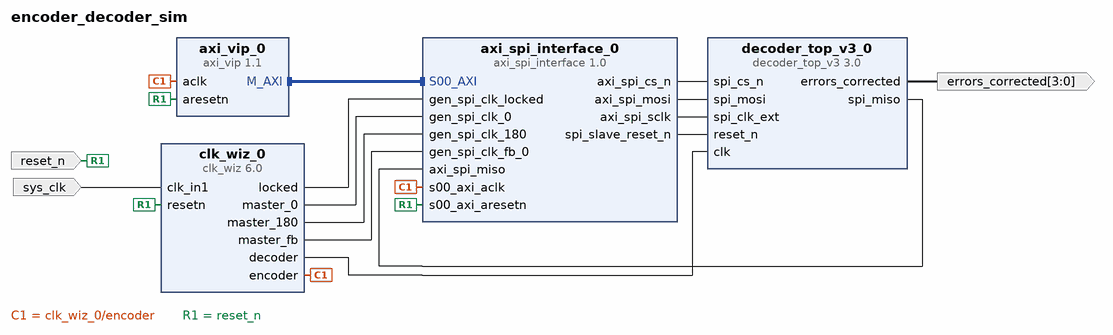
[diagram p0: block diagram of the top level]
# Vivado block design encoder_decoder_sim, xc7z020clg484-1, Vivado 2022.1
create_bd_design encoder_decoder_sim

create_bd_port -dir I -type rst reset_n
create_bd_port -dir I -type clk sys_clk
set_property -dict {CONFIG.FREQ_HZ 100000000} [get_bd_ports sys_clk]
create_bd_port -dir O -from 3 -to 0 -type data errors_corrected

create_bd_cell -type ip -vlnv xilinx.com:user:axi_spi_interface:1.0 axi_spi_interface_0
set_property -dict [list \
  CONFIG.SPI_CLK_FB_DELAY_WIDTH 4 \
  CONFIG.SPI_DUMMY_BITS_BEG 1 \
  CONFIG.SPI_DUMMY_BITS_END 1 \
  CONFIG.SPI_INIT_INTERVAL 1 \
  CONFIG.SPI_SHIFT_IN_COMP 1 \
] [get_bd_cells axi_spi_interface_0]
create_bd_cell -type ip -vlnv xilinx.com:ip:axi_vip:1.1 axi_vip_0
set_property -dict [list \
  CONFIG.ADDR_WIDTH 32 \
  CONFIG.DATA_WIDTH 32 \
  CONFIG.HAS_BRESP 1 \
  CONFIG.HAS_PROT 1 \
  CONFIG.HAS_RRESP 1 \
  CONFIG.HAS_WSTRB 1 \
  CONFIG.INTERFACE_MODE MASTER \
  CONFIG.PROTOCOL AXI4LITE \
  CONFIG.READ_WRITE_MODE READ_WRITE \
] [get_bd_cells axi_vip_0]
create_bd_cell -type ip -vlnv xilinx.com:ip:clk_wiz:6.0 clk_wiz_0
set_property -dict [list \
  CONFIG.CLKOUT1_JITTER 159.475 \
  CONFIG.CLKOUT1_PHASE_ERROR 105.461 \
  CONFIG.CLKOUT1_REQUESTED_OUT_FREQ 50.000 \
  CONFIG.CLKOUT2_JITTER 159.475 \
  CONFIG.CLKOUT2_PHASE_ERROR 105.461 \
  CONFIG.CLKOUT2_REQUESTED_OUT_FREQ 50.000 \
  CONFIG.CLKOUT2_REQUESTED_PHASE 180.000 \
  CONFIG.CLKOUT2_USED true \
  CONFIG.CLKOUT3_JITTER 137.681 \
  CONFIG.CLKOUT3_PHASE_ERROR 105.461 \
  CONFIG.CLKOUT3_USED true \
  CONFIG.CLKOUT4_JITTER 137.681 \
  CONFIG.CLKOUT4_PHASE_ERROR 105.461 \
  CONFIG.CLKOUT4_REQUESTED_PHASE 10.000 \
  CONFIG.CLKOUT4_USED true \
  CONFIG.CLKOUT5_JITTER 159.475 \
  CONFIG.CLKOUT5_PHASE_ERROR 105.461 \
  CONFIG.CLKOUT5_REQUESTED_OUT_FREQ 50.000 \
  CONFIG.CLKOUT5_USED true \
  CONFIG.CLKOUT6_JITTER 183.467 \
  CONFIG.CLKOUT6_PHASE_ERROR 105.461 \
  CONFIG.CLKOUT6_REQUESTED_OUT_FREQ 100.000 \
  CONFIG.CLKOUT6_REQUESTED_PHASE 0.000 \
  CONFIG.CLKOUT6_USED false \
  CONFIG.CLKOUT7_JITTER 183.467 \
  CONFIG.CLKOUT7_PHASE_ERROR 105.461 \
  CONFIG.CLKOUT7_REQUESTED_OUT_FREQ 100.000 \
  CONFIG.CLKOUT7_REQUESTED_PHASE 0.000 \
  CONFIG.CLKOUT7_USED false \
  CONFIG.CLK_OUT1_PORT master_0 \
  CONFIG.CLK_OUT2_PORT master_180 \
  CONFIG.CLK_OUT3_PORT encoder \
  CONFIG.CLK_OUT4_PORT decoder \
  CONFIG.CLK_OUT5_PORT master_fb \
  CONFIG.CLK_OUT6_PORT clk_out6 \
  CONFIG.CLK_OUT7_PORT clk_out7 \
  CONFIG.MMCM_CLKFBOUT_MULT_F 9.000 \
  CONFIG.MMCM_CLKOUT0_DIVIDE_F 18.000 \
  CONFIG.MMCM_CLKOUT1_DIVIDE 18 \
  CONFIG.MMCM_CLKOUT1_PHASE 180.000 \
  CONFIG.MMCM_CLKOUT2_DIVIDE 9 \
  CONFIG.MMCM_CLKOUT3_DIVIDE 9 \
  CONFIG.MMCM_CLKOUT3_PHASE 10.000 \
  CONFIG.MMCM_CLKOUT4_DIVIDE 18 \
  CONFIG.MMCM_CLKOUT5_DIVIDE 1 \
  CONFIG.MMCM_CLKOUT5_PHASE 0.000 \
  CONFIG.MMCM_CLKOUT6_DIVIDE 1 \
  CONFIG.MMCM_CLKOUT6_PHASE 0.000 \
  CONFIG.NUM_OUT_CLKS 5 \
  CONFIG.PRIM_IN_FREQ 100.000 \
  CONFIG.RESET_PORT resetn \
  CONFIG.RESET_TYPE ACTIVE_LOW \
] [get_bd_cells clk_wiz_0]
create_bd_cell -type ip -vlnv xilinx.com:user:decoder_top_v3:3.0 decoder_top_v3_0
set_property -dict {CONFIG.COMMS_DEBUG true CONFIG.SHIFT_IN_COMP 1} [get_bd_cells decoder_top_v3_0]

# ---- connections ----

connect_bd_intf_net [get_bd_intf_pins axi_vip_0/M_AXI] [get_bd_intf_pins axi_spi_interface_0/S00_AXI]
connect_bd_net [get_bd_pins axi_spi_interface_0/axi_spi_cs_n] [get_bd_pins decoder_top_v3_0/spi_cs_n]
connect_bd_net [get_bd_pins axi_spi_interface_0/axi_spi_mosi] [get_bd_pins decoder_top_v3_0/spi_mosi]
connect_bd_net [get_bd_pins axi_spi_interface_0/axi_spi_sclk] [get_bd_pins decoder_top_v3_0/spi_clk_ext]
connect_bd_net [get_bd_pins axi_spi_interface_0/spi_slave_reset_n] [get_bd_pins decoder_top_v3_0/reset_n]
connect_bd_net -net clk_wiz_0_clk_out3 [get_bd_pins clk_wiz_0/encoder] [get_bd_pins axi_spi_interface_0/s00_axi_aclk] [get_bd_pins axi_vip_0/aclk]
connect_bd_net [get_bd_pins clk_wiz_0/decoder] [get_bd_pins decoder_top_v3_0/clk]
connect_bd_net [get_bd_pins clk_wiz_0/locked] [get_bd_pins axi_spi_interface_0/gen_spi_clk_locked]
connect_bd_net [get_bd_pins clk_wiz_0/master_0] [get_bd_pins axi_spi_interface_0/gen_spi_clk_0]
connect_bd_net [get_bd_pins clk_wiz_0/master_180] [get_bd_pins axi_spi_interface_0/gen_spi_clk_180]
connect_bd_net [get_bd_pins clk_wiz_0/master_fb] [get_bd_pins axi_spi_interface_0/gen_spi_clk_fb_0]
connect_bd_net [get_bd_pins decoder_top_v3_0/errors_corrected] [get_bd_ports errors_corrected]
connect_bd_net [get_bd_pins decoder_top_v3_0/spi_miso] [get_bd_pins axi_spi_interface_0/axi_spi_miso]
connect_bd_net [get_bd_ports reset_n] [get_bd_pins axi_spi_interface_0/s00_axi_aresetn] [get_bd_pins axi_vip_0/aresetn] [get_bd_pins clk_wiz_0/resetn]
connect_bd_net [get_bd_ports sys_clk] [get_bd_pins clk_wiz_0/clk_in1]

# ---- address map ----
assign_bd_address -offset 0x44A00000 -range 64K -target_address_space [get_bd_addr_spaces axi_vip_0/Master_AXI] [get_bd_addr_segs axi_spi_interface_0/S00_AXI/S00_AXI_reg]

validate_bd_design
save_bd_design
